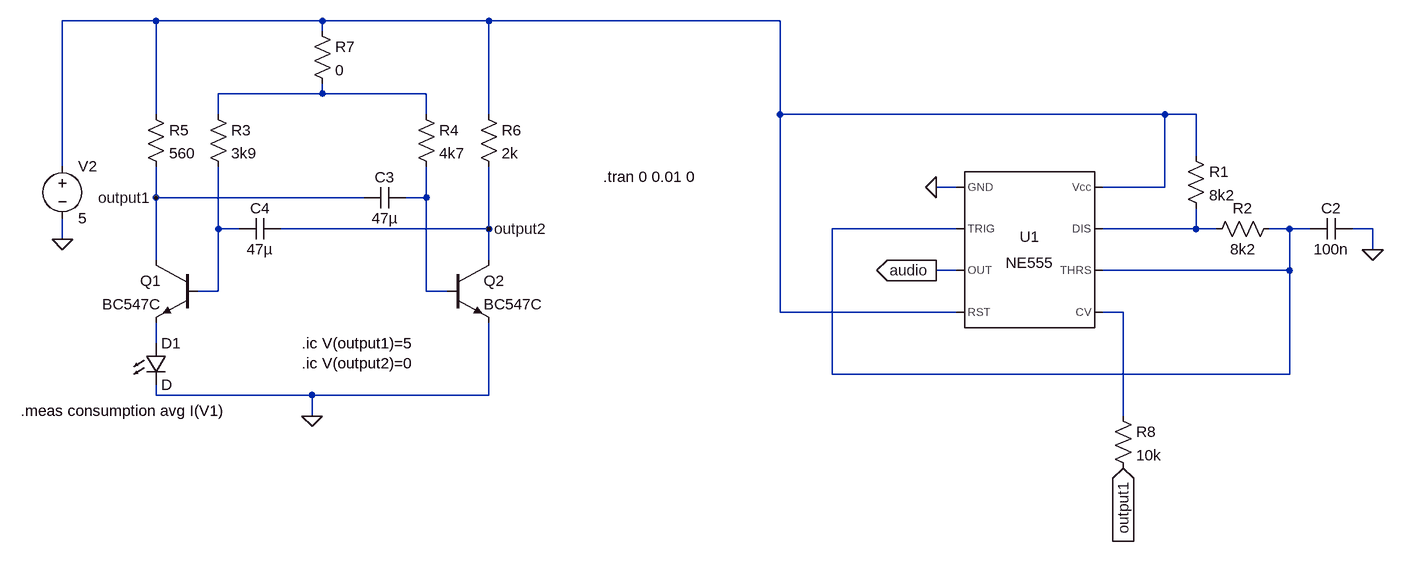
[diagram p0: schematic Draft1.asc]
Draft1.asc, the LTspice schematic file:
Version 4
SHEET 1 1136 776
WIRE -752 -48 -896 -48
WIRE -496 -48 -752 -48
WIRE -240 -48 -496 -48
WIRE 208 -48 -240 -48
WIRE -496 -32 -496 -48
WIRE -496 64 -496 48
WIRE -496 64 -656 64
WIRE -336 64 -496 64
WIRE -752 96 -752 -48
WIRE -656 96 -656 64
WIRE -336 96 -336 64
WIRE -240 96 -240 -48
WIRE 208 96 208 -48
WIRE 800 96 208 96
WIRE 848 96 800 96
WIRE 848 160 848 96
WIRE -896 176 -896 -48
WIRE 480 208 448 208
WIRE 800 208 800 96
WIRE 800 208 704 208
WIRE -752 224 -752 176
WIRE -432 224 -752 224
WIRE -336 224 -336 176
WIRE -336 224 -368 224
WIRE -656 272 -656 176
WIRE -624 272 -656 272
WIRE -240 272 -240 176
WIRE -240 272 -560 272
WIRE 480 272 288 272
WIRE 848 272 848 240
WIRE 848 272 704 272
WIRE 880 272 848 272
WIRE 992 272 960 272
WIRE 1024 272 992 272
WIRE 1120 272 1088 272
WIRE -896 288 -896 256
WIRE 1120 304 1120 272
WIRE -752 320 -752 224
WIRE -240 320 -240 272
WIRE 480 336 448 336
WIRE 992 336 992 272
WIRE 992 336 704 336
WIRE -656 368 -656 272
WIRE -656 368 -688 368
WIRE -336 368 -336 224
WIRE -304 368 -336 368
WIRE 208 400 208 96
WIRE 480 400 208 400
WIRE 736 400 704 400
WIRE -752 448 -752 416
WIRE 288 496 288 272
WIRE 992 496 992 336
WIRE 992 496 288 496
WIRE -752 528 -752 512
WIRE -512 528 -752 528
WIRE -240 528 -240 416
WIRE -240 528 -512 528
WIRE -512 560 -512 528
WIRE 736 560 736 400
FLAG 448 208 0
FLAG 448 336 audio
IOPIN 448 336 Out
FLAG 1120 304 0
FLAG -512 560 0
FLAG -896 288 0
FLAG -752 224 output1
FLAG -240 272 output2
FLAG 736 640 output1
IOPIN 736 640 In
SYMBOL NE555 592 304 R0
SYMATTR InstName U1
SYMBOL Res 832 144 R0
SYMATTR InstName R1
SYMATTR Value 8k2
SYMBOL Res 976 256 R90
WINDOW 0 0 56 VBottom 2
WINDOW 3 32 56 VTop 2
SYMATTR InstName R2
SYMATTR Value 8k2
SYMBOL Cap 1088 256 R90
WINDOW 0 0 32 VBottom 2
WINDOW 3 32 32 VTop 2
SYMATTR InstName C2
SYMATTR Value 100n
SYMBOL npn -688 320 M0
SYMATTR InstName Q1
SYMATTR Value BC547C
SYMBOL npn -304 320 R0
SYMATTR InstName Q2
SYMATTR Value BC547C
SYMBOL Cap -368 208 R90
WINDOW 0 0 32 VBottom 2
WINDOW 3 32 32 VTop 2
SYMATTR InstName C3
SYMATTR Value 47µ
SYMBOL Cap -560 256 R90
WINDOW 0 0 32 VBottom 2
WINDOW 3 32 32 VTop 2
SYMATTR InstName C4
SYMATTR Value 47µ
SYMBOL Res -672 80 R0
SYMATTR InstName R3
SYMATTR Value 3k9
SYMBOL Res -352 80 R0
SYMATTR InstName R4
SYMATTR Value 4k7
SYMBOL Res -768 80 R0
SYMATTR InstName R5
SYMATTR Value 560
SYMBOL Res -256 80 R0
SYMATTR InstName R6
SYMATTR Value 2k
SYMBOL Voltage -896 160 R0
SYMATTR InstName V2
SYMATTR Value 5
SYMBOL LED -768 448 R0
SYMATTR InstName D1
SYMBOL Res -512 -48 R0
SYMATTR InstName R7
SYMATTR Value 0
SYMBOL Res 720 544 R0
SYMATTR InstName R8
SYMATTR Value 10k
TEXT -64 192 Left 2 !.tran 0 0.01 0
TEXT -528 448 Left 2 !.ic V(output1)=5\n.ic V(output2)=0
TEXT -960 552 Left 2 !.meas consumption avg I(V1)

The netlist it stands for:
* Draft1.asc
XU1 0 N005 audio N001 N007 N005 N006 N001 NE555  ; pins GND TRIG OUT RST CV THRS DIS Vcc
R1 N001 N006 8k2
R2 N005 N006 8k2
C2 0 N005 100n
Q1 output1 N004 N008 0 BC547C
Q2 output2 N003 0 0 BC547C
C3 N003 output1 47µ
C4 output2 N004 47µ
R3 N002 N004 3k9
R4 N002 N003 4k7
R5 N001 output1 560
R6 N001 output2 2k
V2 N001 0 5
D1 N008 0 D
R7 N001 N002 0
R8 N007 output1 10k
.model D D
.lib standard.dio
.model NPN NPN
.model PNP PNP
.lib standard.bjt
.tran 0 0.01 0
.ic V(output1)=5
.ic V(output2)=0
.meas consumption avg I(V1)
.lib NE555.sub
.backanno
.end